# Altium project iterptines.PrjPcb
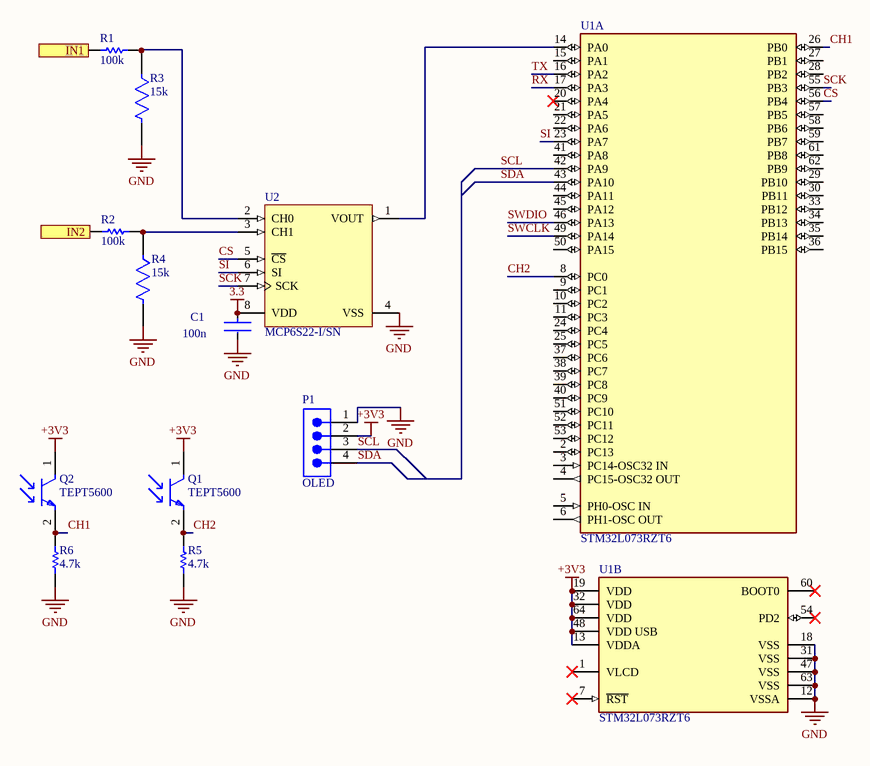
[diagram p0: schema.SchDoc]
1 sheet, 12 parts. Net scope: flat (ports and power ports of the same name join across sheets).

## Sheet schema.SchDoc: Title
size A4; Date: *******; ApprovedBy: *******; CheckedBy: None; Author: *******; CompanyName: *******; DrawnBy: Name; Engineer: *******; Organization: *******; Address1: *******; Address2: *******; Address3: *******; Address4: *******; DocumentNumber: Doc Num; Revision: *******; SheetNumber: 1; SheetTotal: 1; CurrentTime: *******; CurrentDate: *******; Time: *******; DocumentFullPathAndName: *******; DocumentName: *******; ModifiedDate: *******; ImagePath: *******; ProjectName: *******; Application_BuildNumber: *******

### Parts
C1  100n  [FP-0402B104K500CT-IPC_C]
P1  OLED  [SMTC-MTSW-104-07-X-S-170]
Q1  TEPT5600  [FP-6_544-5410_01-4-MFG]
Q2  TEPT5600  [FP-6_544-5410_01-4-MFG]
R1  100k  [RESC1005X40X25ML10T10]
R2  100k  [RESC1005X40X25ML10T10]
R3  15k  [FP-CRGP0603-IPC_C]
R4  15k  [FP-CRGP0603-IPC_C]
R5  4.7k  [RESC2512(6432)_N]
R6  4.7k  [RESC2512(6432)_N]
U1  STM32L073RZT6  [FP-LQFP64-5W-MFG]  (parts A,B of 2)
U2  MCP6S22-I/SN  [SOIC-SN8_M]

### Ports
IN1, IN2

### Nets
3.3: C1.1 U2.8(VDD)
+3V3: P1.2 Q1.1(C) Q2.1(C) U1.13(VDDA) U1.19(VDD) U1.32(VDD) U1.48(VDD_USB) U1.64(VDD)
GND: C1.2 P1.1 R3.2 R4.2 R5.1 R6.1 U1.12(VSSA) U1.18(VSS) U1.31(VSS) U1.47(VSS) U1.63(VSS) U2.4(VSS)
CH1: Q2.2(E) R6.2 U1.26(PB0)
CH2: Q1.2(E) R5.2 U1.8(PC0)
CS: U1.56(PB4) U2.5(~{CS})
RX: U1.17(PA3)
SCK: U1.55(PB3) U2.7(SCK)
SCL: P1.3 U1.42(PA9)
SDA: P1.4 U1.43(PA10)
SI: U1.23(PA7) U2.6(SI)
SWCLK: U1.49(PA14)
SWDIO: U1.46(PA13)
TX: U1.16(PA2)
NetR1_2: R1.2 R3.1 U2.2(CH0)
NetR2_2: R2.2 R4.1 U2.3(CH1)
NetU1_14: U1.14(PA0) U2.1(VOUT)

Not connected (* = marked no-connect by the designer): R1 1; R2 1; U1 1(VLCD)* 2(PC13) 3(PC14-OSC32_IN) 4(PC15-OSC32_OUT) 5(PH0-OSC_IN) 6(PH1-OSC_OUT) 7(~{RST})* 9(PC1) 10(PC2) 11(PC3) 15(PA1) 20(PA4)* 21(PA5) 22(PA6) 24(PC4) 25(PC5) 27(PB1) 28(PB2) 29(PB10) 30(PB11) 33(PB12) 34(PB13) 35(PB14) 36(PB15) 37(PC6) 38(PC7) 39(PC8) 40(PC9) 41(PA8) 44(PA11) 45(PA12) 50(PA15) 51(PC10) 52(PC11) 53(PC12) 54(PD2)* 57(PB5) 58(PB6) 59(PB7) 60(BOOT0)* 61(PB8) 62(PB9)

### Notes on the sheet
- Title:
- Author:
- Date:
- Time:
- Sheet:
- of
- File:

### Library data of the parts
C1 = CMP-45632-000010-1: CAP CER 0.1UF 50V X7R 0402; Tolerance: 10%; Capacitance: 100nF; Max Operating Temperature: 125°C; Case Code (Metric): 1005; RoHS Compliant: Yes; Series: -; Case Code (Imperial): 0402; Voltage Rating: 50V; Min Operating Temperature: -55°C; Mount: Surface Mount; Case/Package: 0402; Packaging: Cut Tape
P1 = CMP-1024-00105-1: Modified .025" SQ Post Header, Through-hole, Vertical, -55 to 105 degC, 2.54 mm Pitch, 4-Pin, Male, RoHS; PartNumber: MTSW-104-07-T-S-170; Manufacturer: Samtec; Pitch: 2.54 mm; ComponentLink3Description: Package Specification; ComponentLink2URL: http://www.samtec.com/documents/webfiles/pdf/MTSW.PDF; Temperature Range: -55 to 105 degC; DatasheetVersion: F-214; ComponentLink3URL: http://www.samtec.com/documents/webfiles/cpdf/MTSW-XXX-XX-X-X-XXXX-XX-XXX-MKT1.pdf; Orientation: Vertical; ComponentLink1URL: http://www.samtec.com; RoHS: True; PackageReference: MTSW-104-07-X-S-170; ComponentLink1Description: Manufacturer URL; Mounting Technology: Through-hole; PackageDescription: Assembly .025" [.64] SQ Post Terminal Strip; PackageVersion: BI, 2/1987; ComponentLink2Description: Datasheet
Q1 Q2 = CMP-00030-26751712-1: VEMT2023SLX01 VEMT2023 Series 20 V 50 mA Silicon NPN Phototransistor - SMD-2; Dark Current: 100nA; Collector Emitter Voltage (VCEO): 20V; Collector Emitter Saturation Voltage: 400mV; Viewing Angle: 70°; Power Dissipation: 100mW; Wavelength: 860nm; Lens Style: Domed; Max Collector Current: 50mA; Orientation: Side View; Mount: Surface Mount; RoHS: Compliant; Polarity: NPN; NexarPartId: 26751712; Schedule B: 8541407080, 8541407080; Max Operating Temperature: 100°C; Radiation Hardening: No; Max Breakdown Voltage: 20V; REACH SVHC: Unknown; Max Power Dissipation: 100mW; Collector Emitter Breakdown Voltage: 20V; Number of Pins: 2; Packaging: Tape and Reel; Min Operating Temperature: -40°C; Case/Package: SMD/SMT
R1 R2 = CMP-2002-04583-1: Part Number: SG73P1ETTP1003F; Manufacturer: KOA Speer
R3 R4 = CMP-03211-008902-1: CRGP0603 15KΩ 0.25W ±100ppm/°C 1% 50V; Manufacturer: TE; Manufacturer Part Number: CRGP0603F15K; Tolerance: 0.01; Device Class L2: Resistors; ComponentLink2URL: https://www.te.com/commerce/DocumentDelivery/DDEController?Action=srchrtrv&DocNm=9-1773463-9&DocType=DS&DocLang=English; Composition: Thick Film; Device Class L3: Chip SMD Resistors; Power Rating: 0.25W; Ambient Temperature Range High: +70°C; Package: CRGP0603; Device Class L1: Passive Components; Value: 15KΩ; Temperature Range Low: -55°C; Resistance: 15KΩ; Temperature Range High: +155°C; Voltage Rating: 50V; Category: Res; Octopart: https://octopart.com/crgp0603f15k-te+connectivity-91018729; Ipc Land Pattern Name: RESC16080X45; Series: CRGP; ComponentLink2Description: Datasheet; Height: 0.55mm; RoHS: TRUE; Temperature Coefficient: ±100ppm/°C; Automotive: No; Temperature: -55°C to +155°C; Lead Free: Yes
R5 R6 = CMP-1018-00501-1: 825R 1W 1% 2512 (6432 Metric)  SMD; Case-Metric: 6432; Case-EIA: 2512; Value: 825.00 Ohm; Power: 1 W; Technology: SMT; Tolerance: 1 %
U1 = CMP-12105-000144-1: IC MCU 32BIT 192KB FLASH 64LQFP; Core Architecture: ARM; Interface: I2C; Oscillator Type: Internal; Min Supply Voltage: 1.65V; Frequency: 32MHz; Number of I/Os: 51; RAM Size: 20KB; Peripherals: Brown-out Detect/Reset; Max Supply Voltage: 3.6V; Max Operating Temperature: 85°C; Case/Package: LQFP; RoHS Compliant: Yes; Number of Pins: 64; Min Operating Temperature: -40°C; Memory Type: FLASH; Packaging: Tray; Memory Size: 192KB; REACH SVHC: No SVHC
U2 = CMP-0187-00359-2: Single-Ended, Rail-to-Rail Input/Output, Low-Gain Programmable Gain Amplifier, 8-Pin SOIC, Industrial Temperature; PackageReference: SOIC-SN8; ComponentLink2URL: http://ww1.microchip.com/downloads/en/DeviceDoc/21117a.pdf; PackageVersion: revBB, Aug-2009; ComponentLink3URL: http://www.microchip.com/stellent/groups/techpub_sg/documents/packagingspec/en012702.pdf; ComponentLink1Description: Manufacturer URL; PackageDescription: 8-Lead Plastic Small Outline (SN) - Narrow, 3.90mm Body [SOIC]; ComponentLink1URL: http://www.microchip.com/; RevisionNote: URLs added.; Code_IPC: SOIC127P600-8; ComponentLink3Description: Package Specification; Code_JEDEC: MS-012; ComponentLink2Description: Datasheet; DatasheetVersion: revA, Mar-2003